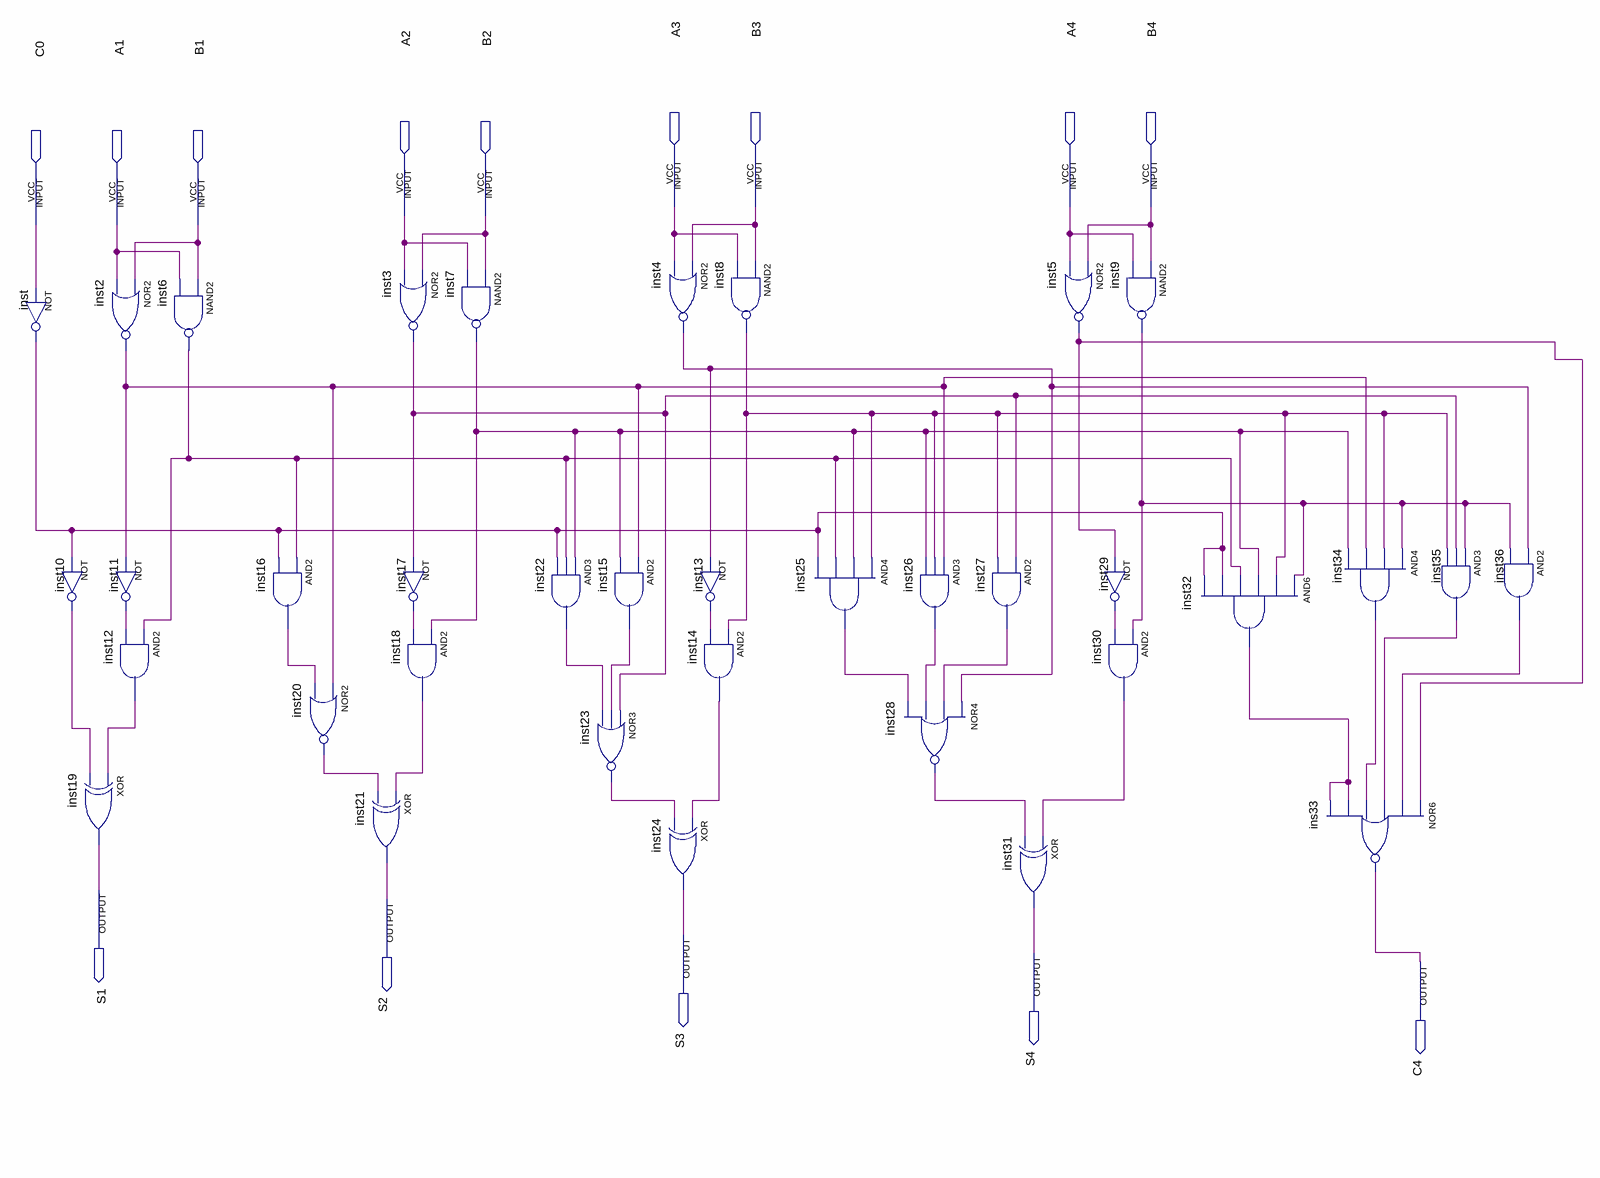
[diagram p0: schematic sheet]
// Quartus schematic 74LS283.bdf as structural Verilog: 36 symbols, 14 pins
module \74LS283  (
  input  A3,
  input  B3,
  input  A4,
  input  B4,
  input  A2,
  input  B2,
  input  C0,
  input  A1,
  input  B1,
  output S1,
  output S2,
  output S3,
  output S4,
  output C4
);

  wire inst2_out, inst3_out, inst4_out, inst5_out, inst6_out, inst7_out, inst8_out, inst9_out, inst10_out,
       inst11_out, inst12_out, inst13_out, inst14_out, inst15_out, inst16_out, inst17_out, inst18_out,
       inst20_out, inst22_out, inst23_out, inst25_out, inst26_out, inst27_out, inst28_out, inst29_out,
       inst30_out, inst32_out, inst34_out, inst35_out, inst36_out, inst_out;

  not inst (inst_out, C0);
  nor inst2 (inst2_out, B1, A1);
  not inst10 (inst10_out, inst_out);
  not inst11 (inst11_out, inst2_out);
  and inst12 (inst12_out, inst6_out, inst11_out);
  xor inst19 (S1, inst12_out, inst10_out);
  nand inst6 (inst6_out, B1, A1);
  and inst16 (inst16_out, inst6_out, inst_out);
  nor inst20 (inst20_out, inst2_out, inst16_out);
  nor inst3 (inst3_out, B2, A2);
  not inst17 (inst17_out, inst3_out);
  and inst18 (inst18_out, inst7_out, inst17_out);
  xor inst21 (S2, inst18_out, inst20_out);
  nand inst7 (inst7_out, B2, A2);
  and inst22 (inst22_out, inst7_out, inst6_out, inst_out);
  and inst15 (inst15_out, inst2_out, inst7_out);
  nor inst23 (inst23_out, inst3_out, inst15_out, inst22_out);
  nor inst4 (inst4_out, B3, A3);
  xor inst24 (S3, inst14_out, inst23_out);
  nand inst8 (inst8_out, B3, A3);
  not inst13 (inst13_out, inst4_out);
  and inst14 (inst14_out, inst8_out, inst13_out);
  and inst25 (inst25_out, inst8_out, inst7_out, inst6_out, inst_out);
  nor inst28 (inst28_out, inst4_out, inst27_out, inst26_out, inst25_out);
  and inst26 (inst26_out, inst2_out, inst8_out, inst7_out);
  and inst27 (inst27_out, inst3_out, inst8_out);
  xor inst31 (S4, inst30_out, inst28_out);
  nor inst5 (inst5_out, B4, A4);
  nand inst9 (inst9_out, B4, A4);
  not inst29 (inst29_out, inst5_out);
  and inst30 (inst30_out, inst9_out, inst29_out);
  and inst32 (inst32_out, inst9_out, inst8_out, inst7_out, inst6_out, inst_out, inst_out);
  and inst34 (inst34_out, inst9_out, inst8_out, inst2_out, inst7_out);
  nor ins33 (C4, inst5_out, inst36_out, inst35_out, inst34_out, inst32_out, inst32_out);
  and inst35 (inst35_out, inst9_out, inst3_out, inst8_out);
  and inst36 (inst36_out, inst4_out, inst9_out);
endmodule
